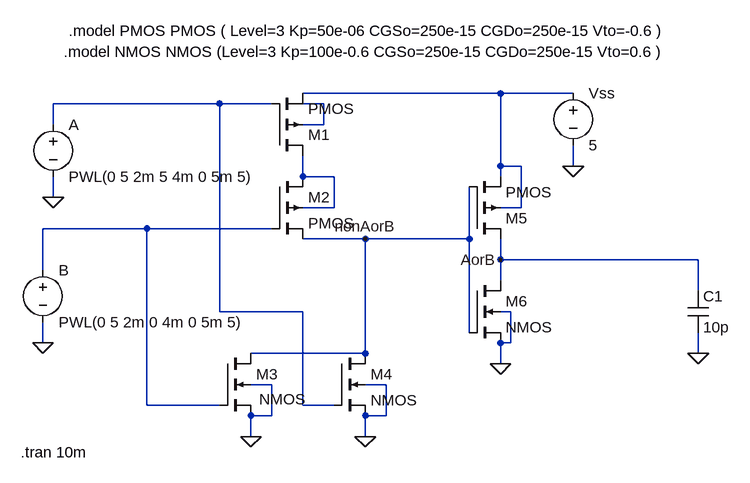
[diagram p0: schematic OR.asc]
OR.asc, the LTspice schematic file:
Version 4
SHEET 1 2236 680
WIRE 688 -160 384 -160
WIRE 800 -160 688 -160
WIRE 256 -144 0 -144
WIRE 336 -144 256 -144
WIRE 416 -144 384 -144
WIRE 0 -112 0 -144
WIRE 416 -112 416 -144
WIRE 416 -112 384 -112
WIRE 688 -48 688 -160
WIRE 720 -48 688 -48
WIRE 800 -48 800 -80
WIRE 384 -32 384 -64
WIRE 432 -32 384 -32
WIRE 688 -32 688 -48
WIRE 0 0 0 -32
WIRE 432 16 432 -32
WIRE 432 16 384 16
WIRE 720 16 720 -48
WIRE 720 16 688 16
WIRE 144 48 -16 48
WIRE 336 48 144 48
WIRE 480 64 384 64
WIRE 640 64 640 -16
WIRE 640 64 480 64
WIRE 688 96 688 64
WIRE 992 96 688 96
WIRE -16 112 -16 48
WIRE 688 128 688 96
WIRE 992 144 992 96
WIRE 256 176 256 -144
WIRE 384 176 256 176
WIRE 704 176 688 176
WIRE 640 208 640 64
WIRE -16 224 -16 192
WIRE 704 224 704 176
WIRE 704 224 688 224
WIRE 480 240 480 64
WIRE 480 240 304 240
WIRE 992 240 992 208
WIRE 688 256 688 224
WIRE 336 288 304 288
WIRE 512 288 480 288
WIRE 144 320 144 48
WIRE 256 320 144 320
WIRE 384 320 384 176
WIRE 432 320 384 320
WIRE 336 336 336 288
WIRE 336 336 304 336
WIRE 512 336 512 288
WIRE 512 336 480 336
WIRE 304 368 304 336
WIRE 480 368 480 336
FLAG 800 -48 0
FLAG 0 0 0
FLAG -16 224 0
FLAG 688 256 0
FLAG 480 368 0
FLAG 304 368 0
FLAG 992 240 0
FLAG 480 64 nonAorB
FLAG 688 96 AorB
SYMBOL pmos4 336 -64 M180
SYMATTR InstName M1
SYMATTR Value2 l=0.75u w=3.75u
SYMBOL pmos4 336 -32 R0
SYMATTR InstName M2
SYMATTR Value2 l=0.75u w=3.5u
SYMBOL nmos4 256 240 R0
WINDOW 3 61 71 Left 2
SYMATTR InstName M3
SYMATTR Value2 l=0.75u w=1.5u
SYMBOL nmos4 432 240 R0
SYMATTR InstName M4
SYMATTR Value2 l=0.75u w=1.5u
SYMBOL voltage 800 -176 R0
WINDOW 123 0 0 Left 0
WINDOW 39 0 0 Left 0
SYMATTR InstName Vss
SYMATTR Value 5
SYMBOL pmos4 640 64 M180
SYMATTR InstName M5
SYMATTR Value2 l=0.75u w=3.75u
SYMBOL nmos4 640 128 R0
SYMATTR InstName M6
SYMATTR Value2 l=0.75u w=1.5u
SYMBOL voltage 0 -128 R0
WINDOW 123 0 0 Left 0
WINDOW 39 0 0 Left 0
SYMATTR InstName A
SYMATTR Value PWL(0 5 2m 5 4m 0 5m 5)
SYMBOL voltage -16 96 R0
WINDOW 123 0 0 Left 0
WINDOW 39 0 0 Left 0
SYMATTR InstName B
SYMATTR Value PWL(0 5 2m 0 4m 0 5m 5)
SYMBOL cap 976 144 R0
SYMATTR InstName C1
SYMATTR Value 10p
TEXT 16 -224 Left 2 !.model NMOS NMOS (Level=3 Kp=100e-0.6 CGSo=250e-15 CGDo=250e-15 Vto=0.6 )
TEXT 24 -256 Left 2 !.model PMOS PMOS ( Level=3 Kp=50e-06 CGSo=250e-15 CGDo=250e-15 Vto=-0.6 )
TEXT -50 392 Left 2 !.tran 10m

The netlist it stands for:
* OR.asc
M1 N004 N002 N001 N003 PMOS l=0.75u w=3.75u
M2 N004 N005 nonAorB N004 PMOS l=0.75u w=3.5u
M3 nonAorB N005 0 0 NMOS l=0.75u w=1.5u
M4 nonAorB N002 0 0 NMOS l=0.75u w=1.5u
Vss N001 0 5
M5 AorB nonAorB N001 N001 PMOS l=0.75u w=3.75u
M6 AorB nonAorB 0 0 NMOS l=0.75u w=1.5u
V§A N002 0 PWL(0 5 2m 5 4m 0 5m 5)
V§B N005 0 PWL(0 5 2m 0 4m 0 5m 5)
C1 AorB 0 10p
.model NMOS NMOS
.model PMOS PMOS
.lib standard.mos
.model NMOS NMOS (Level=3 Kp=100e-0.6 CGSo=250e-15 CGDo=250e-15 Vto=0.6 )
.model PMOS PMOS ( Level=3 Kp=50e-06 CGSo=250e-15 CGDo=250e-15 Vto=-0.6 )
.tran 10m
.backanno
.end